# EAGLE design Grove - Optical Rotary Encoder(TCUT1600X01) (EAGLE 6.4)
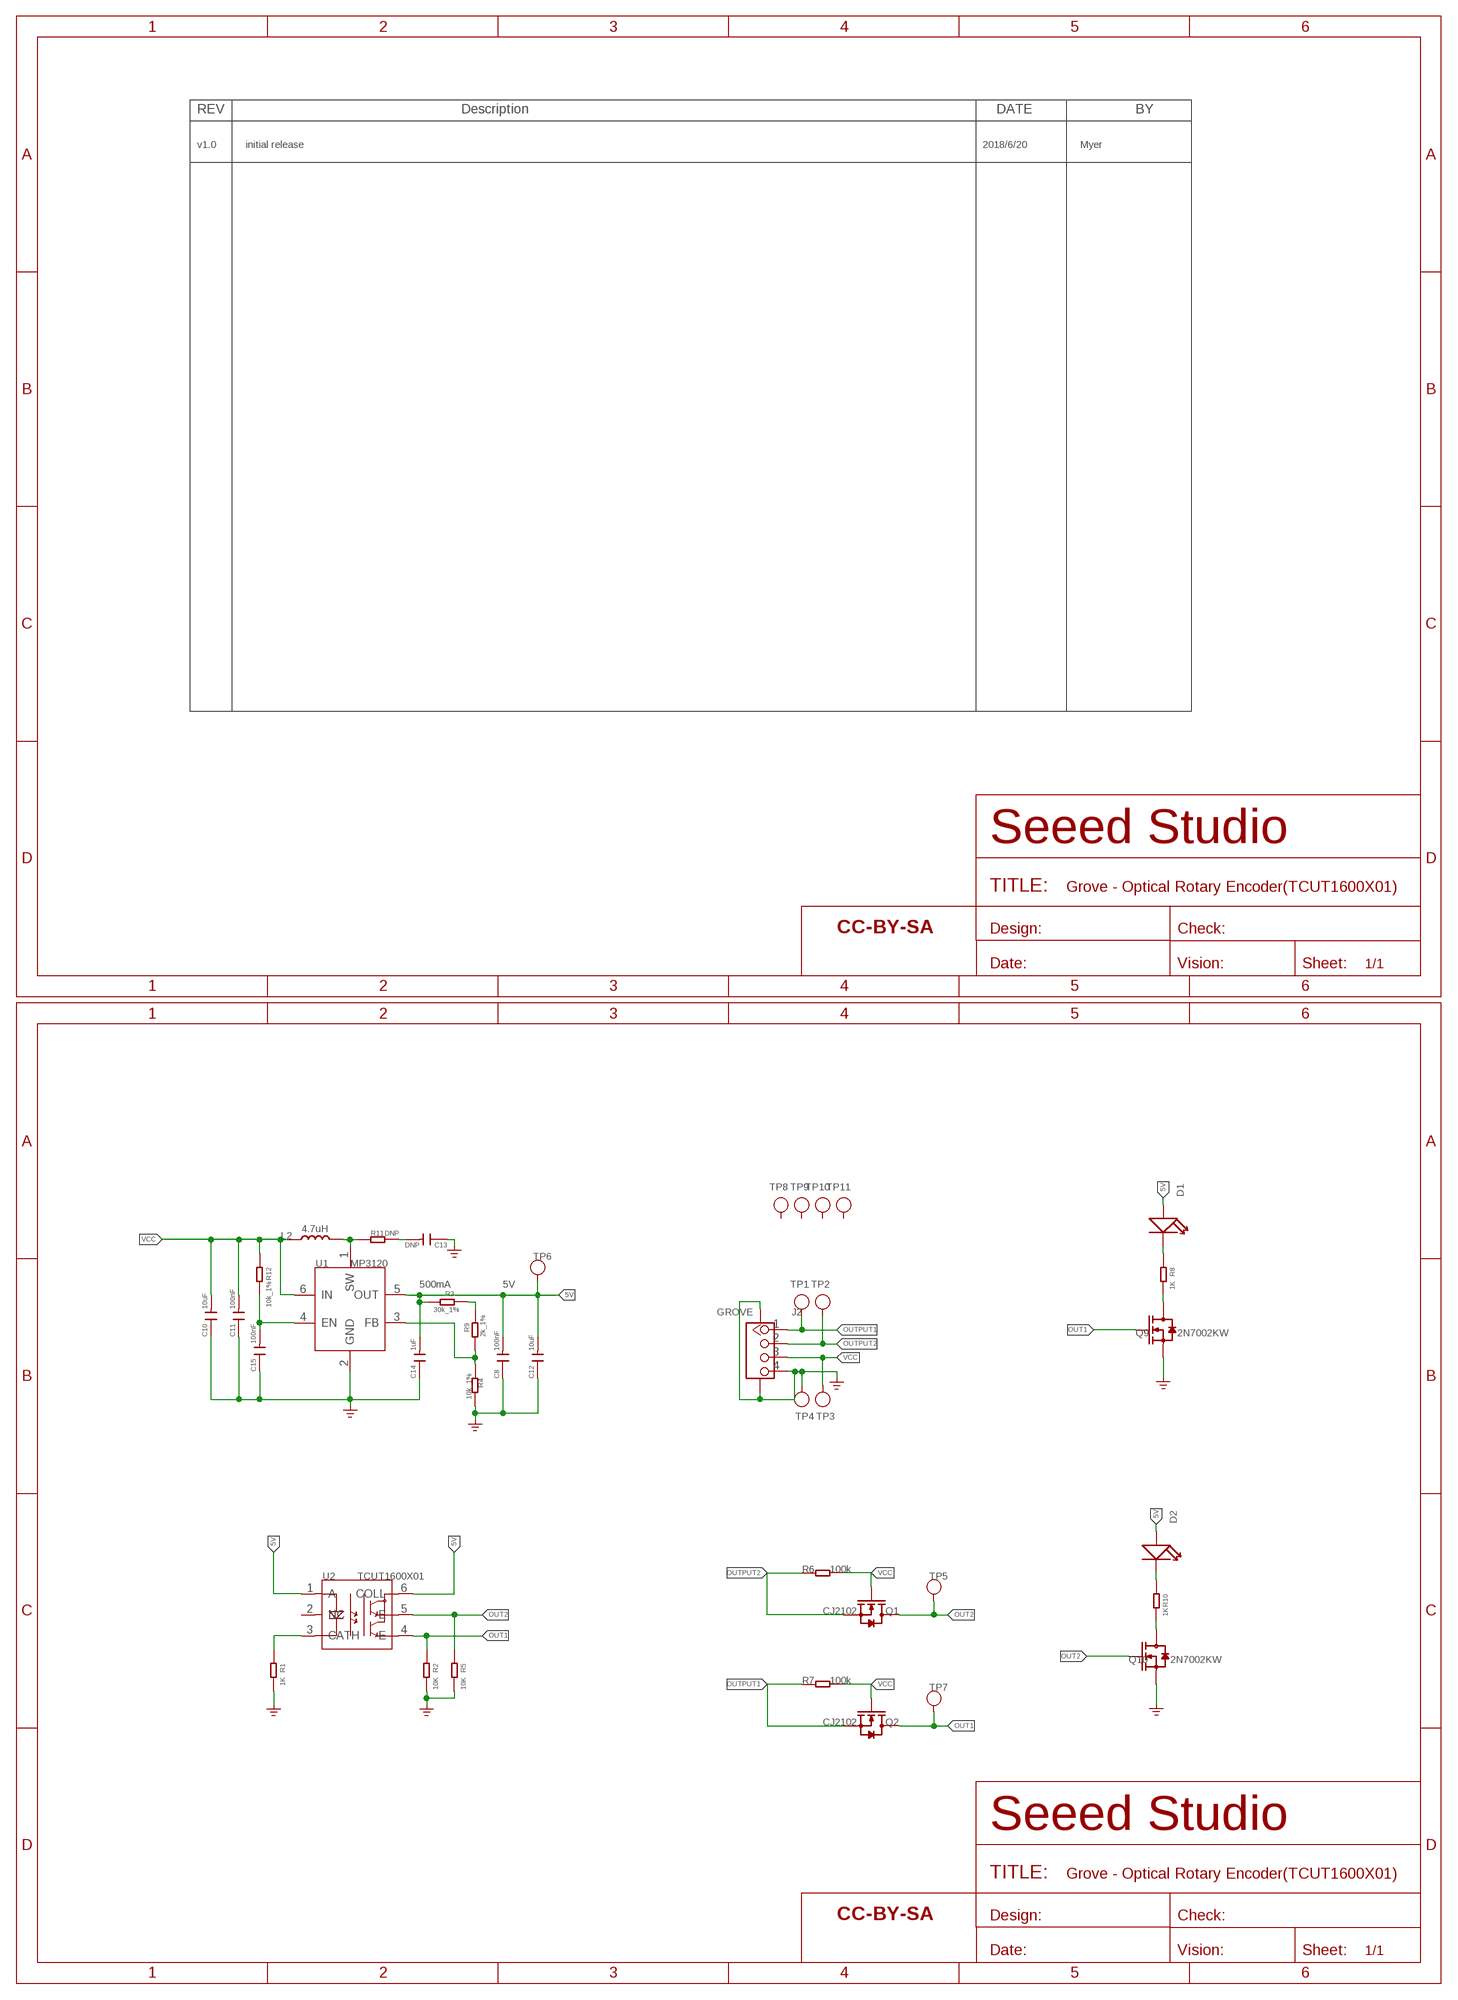
[diagram p0: schematic, sheet 1]

## Parts
C8  100nF  C-0603  [C0603]
C10  10uF  C-0603  [C0603]
C11  100nF  C-0603  [C0603]
C12  10uF  C-0603  [C0603]
C13  DNP  C-0603  [C0603]
C14  1uF  C-0603  [C0603]
C15  100nF  C-0603  [C0603]
D1  LED'0603'  [LED-0603]
D2  LED'0603'  [LED-0603]
FR1  SEEEDSTUDIO-OPEN-SCH-FRAME  [SEEEDSTUDIO-PCB-FRAME]
J2  GROVE  GROVE-CONNECTOR-SMD'DD'  [HW4-SMD-2.0]
L2  4.7uH  LL2016  [L2016]
Q1  CJ2102  MOSFET-N'SOT23'  [SOT-23@1]
Q2  CJ2102  MOSFET-N'SOT23'  [SOT-23@1]
Q9  2N7002KW  MOSFET-N+'SI1304BDL'  [SOT-323]
Q10  2N7002KW  MOSFET-N+'SI1304BDL'  [SOT-323]
R1  1K  R-0603  [R0603]
R2  10K  R-0603  [R0603]
R3  30k_1%  R-0603  [R0603]
R4  10k_1%  R-0603  [R0603]
R5  10K  R-0603  [R0603]
R6  100k  R-0603  [R0603]
R7  100k  R-0603  [R0603]
R8  1K  R-0603  [R0603]
R9  2k_1%  R-0603  [R0603]
R10  1K  R-0603  [R0603]
R11  DNP  R-0603  [R0603]
R12  10k_1%  R-0603  [R0603]
TP1  TEST-POINT'4545'  [TP-D45MIL]
TP2  TEST-POINT'4545'  [TP-D45MIL]
TP3  TEST-POINT'4545'  [TP-D45MIL]
TP4  TEST-POINT'4545'  [TP-D45MIL]
TP5  TEST-POINT'4545'  [TP-D45MIL]
TP6  TEST-POINT'4545'  [TP-D45MIL]
TP7  TEST-POINT'4545'  [TP-D45MIL]
TP8  TEST-POINT'4545'  [TP-D45MIL]
TP9  TEST-POINT'4545'  [TP-D45MIL]
TP10  TEST-POINT'4545'  [TP-D45MIL]
TP11  TEST-POINT'4545'  [TP-D45MIL]
U1  MP3120  CONVERTER-MP3120  [SOT-23-6]
U2  TCUT1600X01  SENSOR-OPTICAL-TCUT1600X01  [SNR6-1.4-5.5X4X5.7MM]
U$4  SEEEDSTUDIO-OPEN-SCH-FRAME  [SEEEDSTUDIO-PCB-FRAME]

## Nets
5V: C8.2 C12.2 C14.2 D1.+ D2.+ R3.2 TP6.T U1.5(OUT) U2.1(A) U2.6(COLL)
GND: C8.1 C10.1 C11.1 C12.1 C13.1 C14.1 C15.1 J2.4 J2.SS1 J2.SS2 Q9.2(S) Q10.2(S) R1.2 R2.2 R4.1 R5.2 TP4.T U1.2(GND) ; supply symbol labelled GND_POWER
N$1: R1.1 U2.3(CATH)
N$3: R4.2 R9.2 U1.3(FB)
N$4: R3.1 R9.1
N$5: L2.2 R11.1 U1.1(SW)
N$11: C13.2 R11.2
N$13: C15.2 R12.2 U1.4(EN)
N$66: Q9.3(D) R8.2
N$105: D1.- R8.1
N$110: Q10.3(D) R10.2
N$111: D2.- R10.1
OUT1: Q2.3(D) Q9.1(G) R2.1 TP7.T U2.4(E)
OUT2: Q1.3(D) Q10.1(G) R5.1 TP5.T U2.5(E)
OUTPUT1: J2.1 Q2.2(S) R7.1 TP1.T
OUTPUT2: J2.2 Q1.2(S) R6.1 TP2.T
VCC: C10.2 C11.2 J2.3 L2.1 Q1.1(G) Q2.1(G) R6.2 R7.2 R12.1 TP3.T U1.6(IN)
Unconnected: TP8.T TP9.T TP10.T TP11.T U2.2(NC)

## Notes on the sheet
- v1.0 | initial release | 2018/6/20 | Myer
- 500mA | 5V

## Library data of the parts
C8 C10-C15 = Discrete-small:C*: Ceramic Capacitors
D1 D2 = Discrete-new:LED
FR1 U$4 = moudle-new:SEEEDSTUDIO-OPEN-SCH-FRAME
J2 = Connector-new:GROVE-CONNECTOR-SMD: 4P-SMD-2.0:320110030;4P-SMD-2.0-90D:320110032
L2 = Discrete-new:L
Q1 Q2 = Discrete-new:MOSFET-N
Q9 Q10 = Discrete-new:MOSFET-N+: IRLL014: http://www.vishay.com/docs/91319/sihll014.pdf
R1-R12 = Discrete-small:R*
TP1-TP11 = Discrete-new:TEST-POINT; PARTNO: DNP
U1 = IC-new:CONVERTER-MP3120
U2 = Discrete-new:SENSOR-OPTICAL-TCUT1600X01

## Net classes
3 usbvcc: width 0.203 mm, drill 0.305 mm, clearance 0.203 mm

## Board
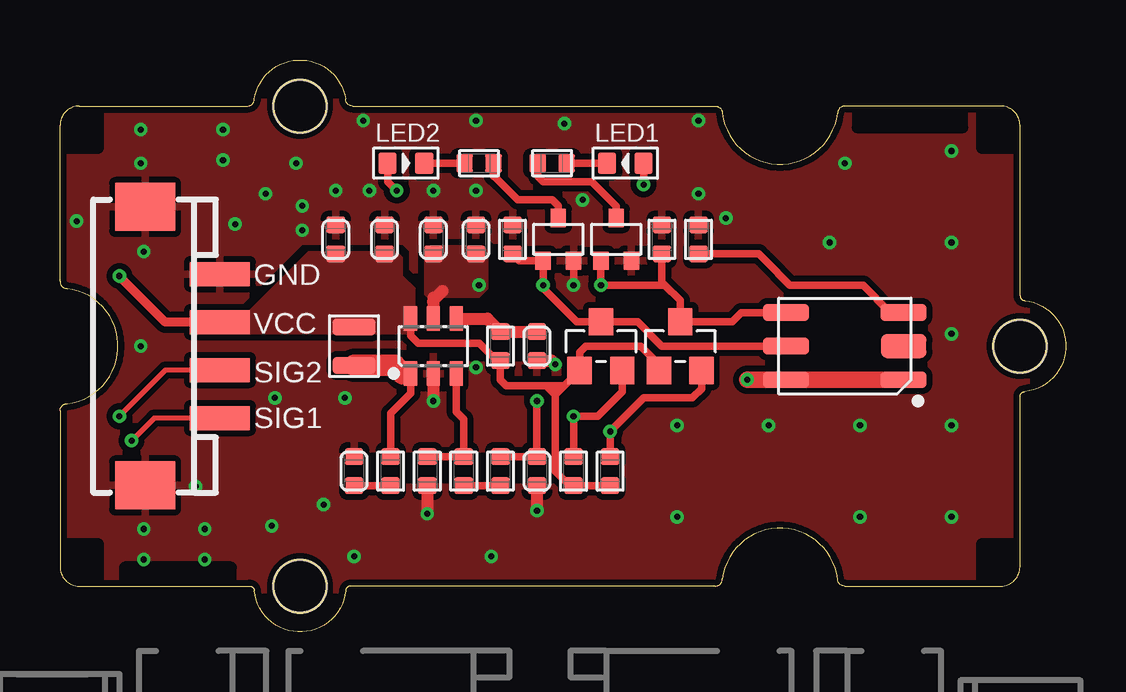
[diagram p1: board, top side]
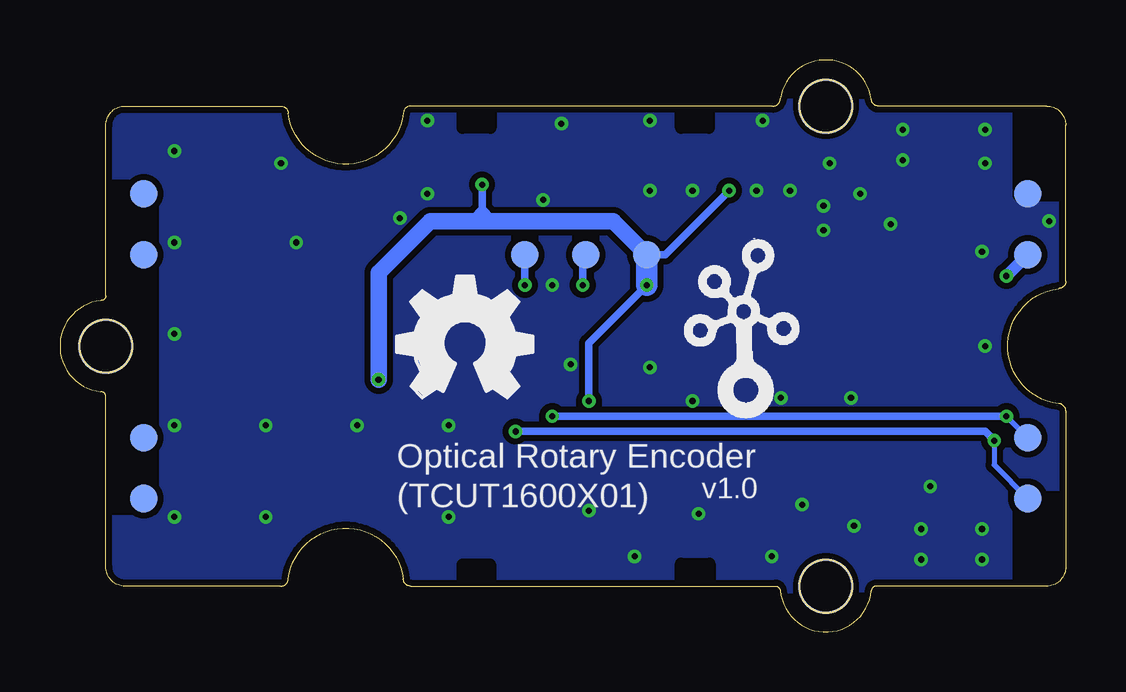
[diagram p2: board, bottom side, seen from below]

Size 41.91 x 23.83 mm. Coordinates in mm from the lower left corner, seen from the top.
Copper layers (1*16): Top 0.035mm / dielectric 1.5mm / Bottom 0.035mm
Design rules "SeeedStudio_2layer_DRU_no_angle_20140221 *": minimum track width 1mil, minimum drill 10mil, track to track 6mil, track to pad 6mil, pad to pad 6mil, via to via 6mil, smd to smd 0mil, copper to edge 10mil, drill to drill 10mil, minimum pad ring 10mil, minimum via ring 6mil, stop-mask expansion 2mil, vias tented up to drill 25mil, thermal gap 10mil
tRestrict: area 11.9,6.4 to 20.8,7.2; area 17,11.5 to 20.6,12.5

### Footprints (pad centres in the part's own frame; a part is rotated, then mirrored left to right if it is on the bottom)
C0603 = smd 0.762 x 0.696: 1 0,0.602; 2 0,-0.602
LED-0603 = smd 0.762 x 0.889: + 0.762,0; - -0.762,0
HW4-SMD-2.0 = smd 1 x 2.5: 1 -3,0; 2 -1,0; 3 1,0; 4 3,0 | smd 2 x 2.5: SS1 -5.8,3.123; SS2 5.8,3.123
L2016 = smd 0.7 x 1.8: 1 -0.8,0; 2 0.8,0
SOT-23@1 = smd 1.143 x 1.016: 1 1.016,-0.889; 2 1.016,0.889; 3 -1.016,0
SOT-323 = smd 0.635 x 0.762: 1 -0.635,-0.889; 2 0.635,-0.889; 3 0,0.889
R0603 = smd 0.762 x 0.696: 1 0,0.602; 2 0,-0.602
TP-D45MIL = smd 1.143 x 1.143: T 0,0
SOT-23-6 = smd 0.55 x 1.016: 1 -0.95,-1.143; 2 0,-1.143; 3 0.95,-1.143; 4 0.95,1.143; 5 0,1.143; 6 -0.95,1.143
SNR6-1.4-5.5X4X5.7MM = smd 1.9 x 0.7: 1 -2.45,1.4; 3 -2.45,-1.4; 4 2.45,-1.4; 5 2.45,0; 6 2.45,1.4 | smd 1.9 x 1: 2 -2.45,0
GROVE-1*2-TEST-PLATFORM-TOP = hole 2.2: 10.635,10; 10.635,-10; -19.365,0

### Placement (x,y rotation side)
C8  17.33,16.35 0 top
C10  11.49,16.35 0 top
C11  13.52,16.35 0 top
C12  15.56,16.35 0 top
C13  12.25,6.7 0 top
C14  19.87,6.7 180 top
C15  19.87,11.91 180 top
D1  23.56,19.53 0 top
D2  14.41,19.53 180 top
FR1  -25.21,-16.16 0 top  (outside the outline)
J2  6.67,11.91 90 top
L2  12.25,11.91 270 top
Q1  22.54,11.91 270 top
Q2  25.84,11.91 270 top
Q9  23.18,16.35 0 top
Q10  20.76,16.35 0 top
R1  26.6,16.35 180 top
R2  25.08,16.35 180 top
R3  18.35,6.7 180 top
R4  15.3,6.7 180 top
R5  18.86,16.35 180 top
R6  21.4,6.7 0 top
R7  22.92,6.7 0 top
R8  20.51,19.53 270 top
R9  16.83,6.7 180 top
R10  17.46,19.53 90 top
R11  13.78,6.7 0 top
R12  18.35,11.91 180 top
TP1  1.59,5.56 0 bottom
TP2  1.59,8.1 0 bottom
TP3  1.59,15.72 0 bottom
TP4  1.59,18.26 0 bottom
TP5  20,15.72 90 bottom
TP6  17.46,15.72 180 bottom
TP7  22.54,15.72 90 bottom
TP8  38.42,5.56 0 bottom
TP9  38.42,8.1 0 bottom
TP10  38.42,15.72 0 bottom
TP11  38.42,18.26 0 bottom
U1  15.56,11.91 0 top
U2  32.7,11.91 180 top
U$4  -23.82,-8.16 0 top  (outside the outline)
U$10  [GROVE-1*2-TEST-PLATFORM-TOP]  20.64,11.91 180 top
U$11  [TWIGLOGO]  13.4,9.88 0 bottom
U$13  [OSHW_FILLX200_NOTEXT]  27.87,9.75 0 bottom

### Tracks (layer width: path | path; a pad name or v marks a point on that pad's centre or on a via)
5V  (via drill 0.25 pad 0.51)
  Top 0.305: R3.2 C14.2 v19.87,9.62 | D2.+ 13.65,18.77 v14.03,18.39 | D1.+ v24.32,18.64
  Top 0.508: 15.56,13.94 15.56,13.81 | U1.5 15.56,13.69 15.56,13.81 | 15.56,13.81 15.94,14.19
  Top 0.686: U2.1 U2.6 v28.64,10.51
  Bottom 0.305: v19.87,9.62 19.87,12.04 v17.46,14.45 | v24.32,18.64 24.32,17.62 | 24.32,17.62 24.32,17.12 | TP6.T 16.7,15.72 v14.03,18.39 | 24.32,17.62 23.94,17.24 | 24.32,17.62 24.7,17.24
  Bottom 0.686: v28.64,10.51 28.64,14.96 26.48,17.12 24.32,17.12 18.86,17.12 TP6.T
  Bottom 0.889: TP6.T v17.46,14.45
  pour Top (isolate 0.254, no thermals): 16.44,16.1 15.43,16.1 15.17,15.85 15.17,14.07 15.3,13.94 17.46,13.94 17.84,14.32 17.84,15.85 17.59,16.1
GND  (via drill 0.25 pad 0.51)
  Top 0.305: Q10.2 v21.4,14.45
  Top 0.508: U1.2 v15.56,9.62 | R4.1 v15.3,4.92 | C14.1 v19.87,5.05 | C15.1 20.48,11.31 v20.64,11.15
  other vias: 9.84,19.53 8.57,18.26 7.3,16.99 3.49,3.02 3.49,4.29 6.03,4.29 32.7,19.53 6.79,20.93 3.36,20.93 6.79,19.66 3.36,19.53 3.49,15.85 6.03,3.02 11.87,9.75 10.09,17.75 10.09,16.73 11.49,18.39 12.89,18.39 15.56,18.39 12.63,21.31 26.6,21.31 21.02,21.18 26.6,18.26 37.15,20.04 17.97,3.15 12.25,3.15 8.82,4.42 5.65,6.07 0.7,17.12 17.33,11.02 3.36,11.91 8.95,9.75 10.98,5.3 37.15,16.23 37.15,12.42 37.15,8.61 37.15,4.8 33.34,8.61 29.53,8.61 25.72,8.61 25.72,4.8 33.34,4.8 32.06,16.23 27.75,17.24 21.78,18 17.33,21.31 17.33,18.39
  pour Bottom (isolate 0.254, rank 6): -0.32,22.07 40.32,22.07 40.32,1.75 -0.32,1.75
  pour Top (isolate 0.254, rank 6): -0.32,22.07 40.32,22.07 40.32,1.75 -0.32,1.75
N$1
  Top 0.305: U2.3 34.6,13.31 33.46,14.45 30.41,14.45 29.4,15.46 29.27,15.59 29.11,15.75 R1.1
N$3
  Top 0.305: U1.3 16.51,9.18 16.83,8.86 R9.2 R4.2
N$4
  Top 0.305: R9.1 R3.1
N$5
  Top 0.305: 14.29,10.77 U1.1 14.61,9.94 13.78,9.11 R11.1
  Top 0.889: 14.29,10.77 13.94,11.11 L2.2
N$11
  Top 0.305: R11.2 C13.2
N$13
  Top 0.508: C15.2 R12.2 17.81,13.05 U1.4
N$66
  Top 0.305: Q9.3 23.18,17.74 22.15,18.77 20.13,18.77 19.91,18.99 R8.2
N$105
  Top 0.305: D1.- R8.1
N$110
  Top 0.305: Q10.3 20.76,17.75 20.51,18 19.07,18 18.33,18.75 18.22,18.86 18.06,19.02 R10.2
N$111
  Top 0.305: R10.1 D2.-
OUT1  (via drill 0.25 pad 0.51)
  Top 0.305: Q2.3 25.84,13.05 | Q2.3 28,12.92 28.38,13.31 U2.4 | R2.1 25.08,14.58 25.21,14.45 | Q2.3 25.84,13.81 25.21,14.45 | Q9.1 v22.54,14.45 25.21,14.45
  Bottom 0.305: TP7.T v22.54,14.45
OUT2  (via drill 0.25 pad 0.51)
  Top 0.305: U2.5 25.08,11.91 24.06,12.92 Q1.3 21.52,12.92 20.13,14.32 v20.13,14.45 Q10.1 19.14,15.46 R5.1
  Bottom 0.305: v20.13,14.45 20.13,15.59 TP5.T
OUTPUT1  (via drill 0.25 pad 0.51)
  Top 0.203: J2.1 3.92,8.91 v2.98,7.97
  Top 0.305: Q2.2 26.73,10.13 26.35,9.75 24.32,9.75 v22.92,8.35 R7.1
  Bottom 0.203: v2.98,7.97 2.98,6.96 TP1.T
  Bottom 0.305: v22.92,8.35 3.36,8.35 v2.98,7.97
OUTPUT2  (via drill 0.25 pad 0.51)
  Top 0.203: J2.2 4.4,10.91 v2.47,8.99
  Top 0.305: R6.1 v21.4,8.99 22.41,8.99 23.43,10 Q1.2
  Bottom 0.203: TP2.T v2.47,8.99
  Bottom 0.305: v2.47,8.99 v21.4,8.99
VCC  (via drill 0.25 pad 0.51)
  Top 0.305: U1.6 14.61,12.35 14.92,12.04 17.46,12.04 18.19,11.31 R12.1 18.35,10.51 18.6,10.26 20.25,10.26 | R7.2 R6.2 21.24,6.1 20.64,6.7 20.64,9.88 | 20.25,10.26 20.64,10.26 | 20.64,10.26 21.02,10.26 | 21.02,10.26 Q1.1 21.65,11.65 21.91,11.91 24.19,11.91 24.95,11.15 Q2.1 | 20.64,9.88 20.64,10.26 | 20.64,9.88 20.25,10.26 | 20.64,9.88 21.02,10.26
  Top 0.381: J2.3 4.4,12.91 v2.47,14.83
  Bottom 0.508: TP3.T v2.47,14.83
  pour Top (isolate 0.254, no thermals): 7.81,12.42 14.54,12.42 14.79,12.67 14.79,14.32 14.29,14.83 14.29,15.59 14.03,15.85 10.35,15.85 7.81,13.31

### Text on the board
bPlace: Optical Rotary Encoder | v1.0 | (TCUT1600X01)
tNames: LED2 | LED1 | GND | VCC | SIG2 | SIG1